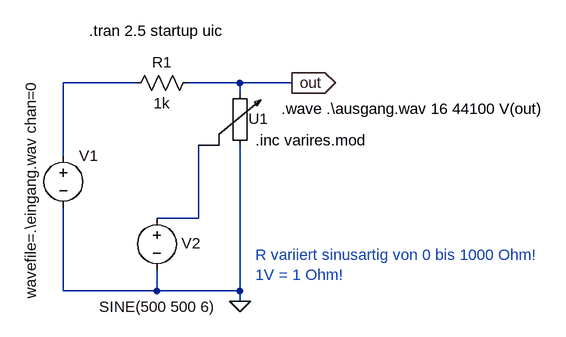
[diagram p0: schematic varires.asc]
varires.asc, the LTspice schematic file:
Version 4
SHEET 1 2056 680
WIRE -48 -112 -160 -112
WIRE 112 -112 32 -112
WIRE 192 -112 112 -112
WIRE 112 -96 112 -112
WIRE -160 0 -160 -112
WIRE 48 96 48 -16
WIRE 48 96 -16 96
WIRE -160 208 -160 80
WIRE -16 208 -16 176
WIRE -16 208 -160 208
WIRE 112 208 112 -16
WIRE 112 208 -16 208
WIRE 112 224 112 208
FLAG 112 224 0
FLAG 192 -112 out
IOPIN 192 -112 Out
SYMBOL voltage -16 80 R0
WINDOW 0 38 55 Left 0
WINDOW 123 0 0 Left 0
WINDOW 39 0 0 Left 0
WINDOW 3 -89 152 Left 0
SYMATTR InstName V2
SYMATTR Value SINE(500 500 6)
SYMBOL res 48 -128 R90
WINDOW 0 0 56 VBottom 0
WINDOW 3 32 56 VTop 0
SYMATTR InstName R1
SYMATTR Value 1k
SYMBOL voltage -160 -16 R0
WINDOW 3 -50 -101 VRight 0
WINDOW 123 0 0 Left 0
WINDOW 39 0 0 Left 0
SYMATTR Value wavefile=.\eingang.wav chan=0
SYMATTR InstName V1
SYMBOL varires 96 -112 R0
SYMATTR InstName U1
TEXT -120 -192 Left 0 !.tran 2.5 startup uic
TEXT 176 -72 Left 0 !.wave .\\ausgang.wav 16 44100 V(out)
TEXT 136 152 Left 0 ;R variiert sinusartig von 0 bis 1000 Ohm!\n1V = 1 Ohm!
TEXT 136 -24 Left 0 !.inc varires.mod

The netlist it stands for:
* varires.asc
V2 N002 0 SINE(500 500 6)
R1 out N001 1k
V1 N001 0 wavefile=.\eingang.wav chan=0
XU1 out 0 N002 varires  ; pins 1 2 CTRL
.tran 2.5 startup uic
.wave .\ausgang.wav 16 44100 V(out)
* R variiert sinusartig von 0 bis 1000 Ohm!
* 1V = 1 Ohm!
.inc varires.mod
.backanno
.end